# Altium schematic sheet 12-SoC POWER2.SchDoc
size 513 x 386 mm
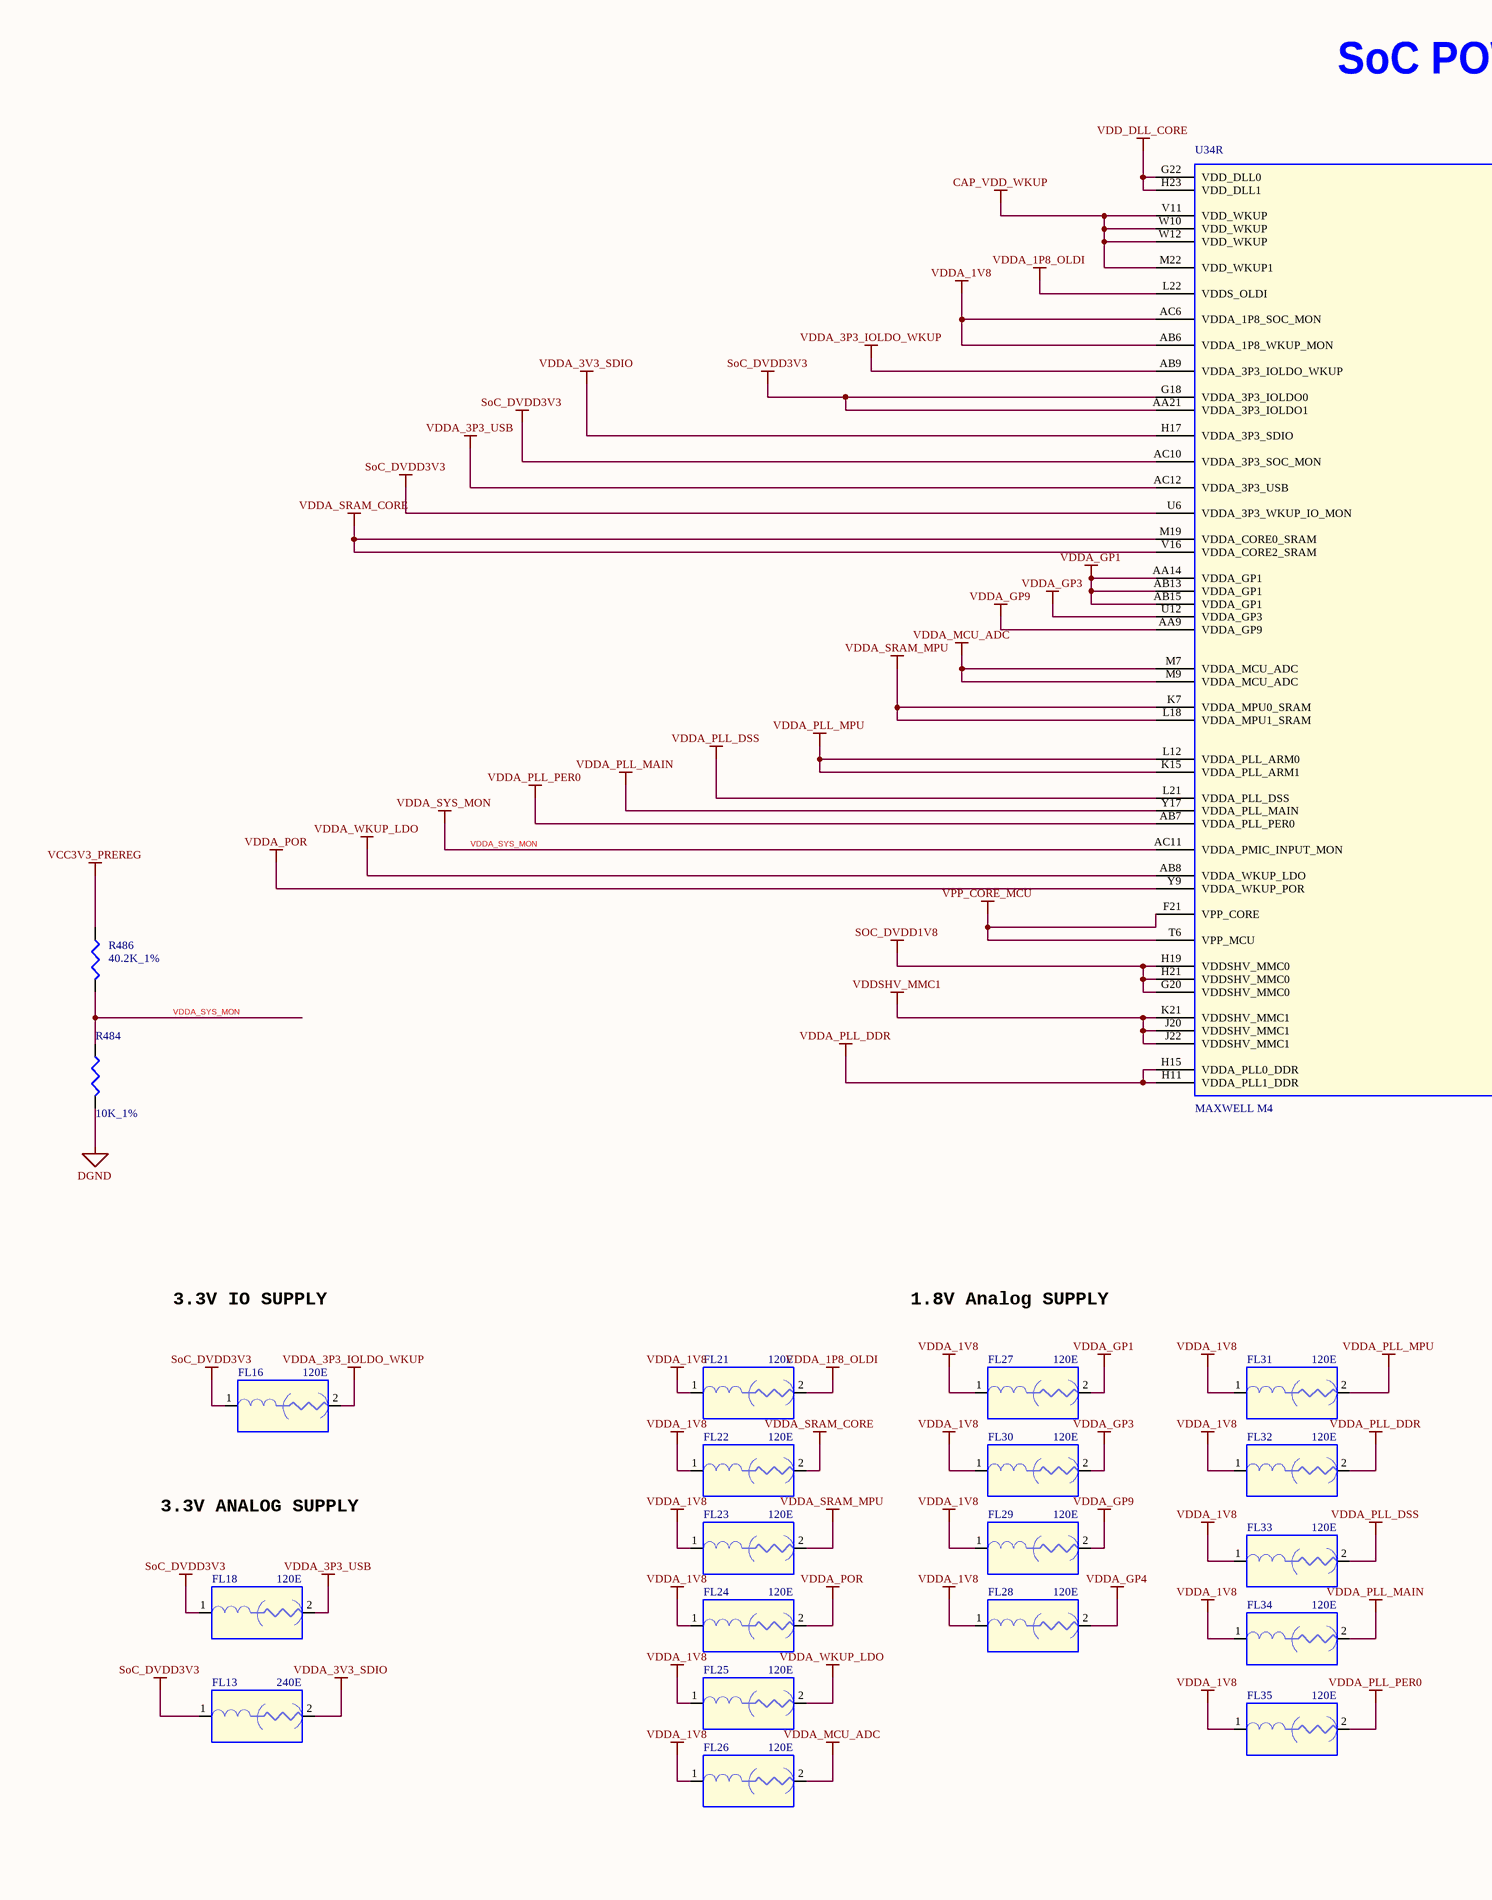
[diagram p0: 12-SoC POWER2.SchDoc, left]
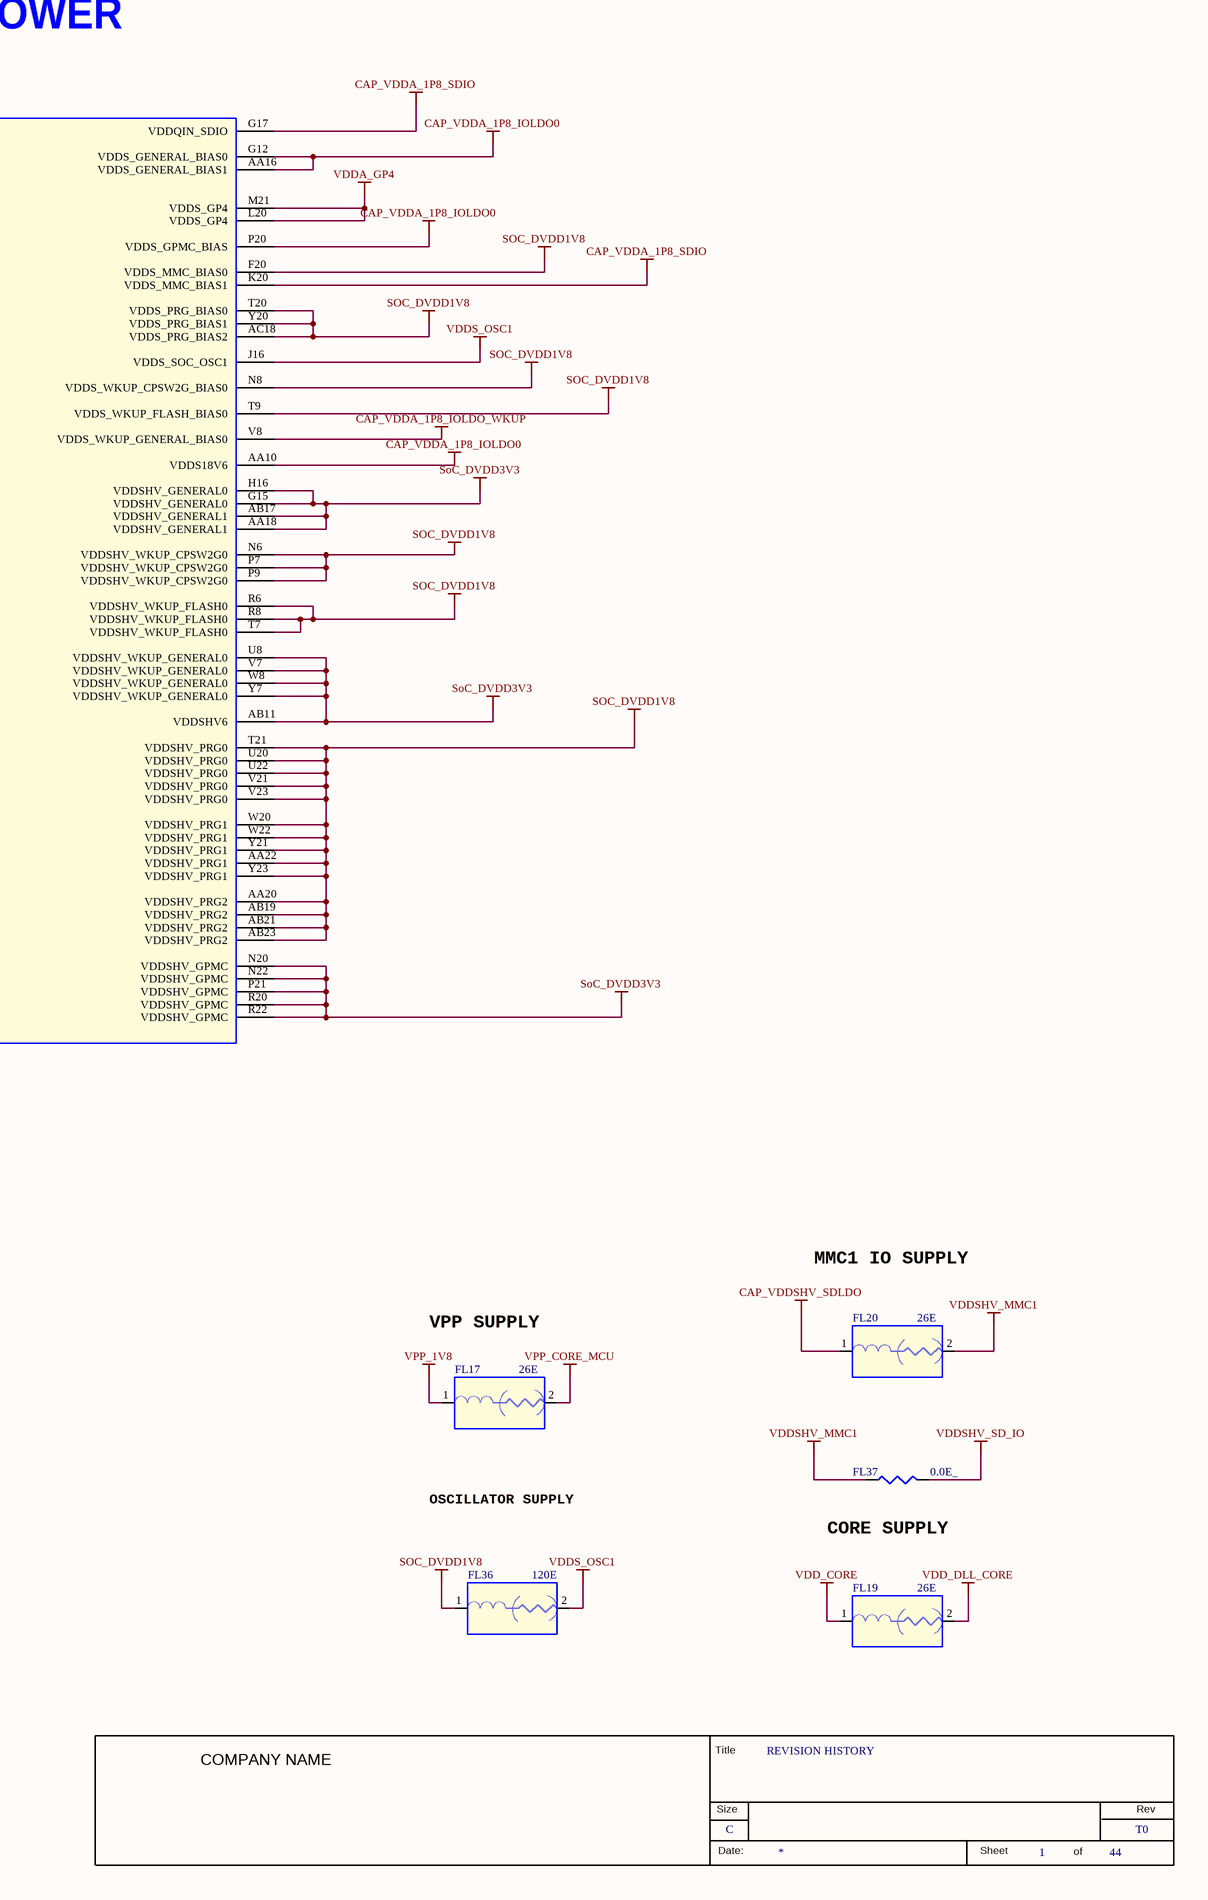
[diagram p1: 12-SoC POWER2.SchDoc, right]

## Parts
*  RevCode: T0  Title: REVISION HISTORY  Page Size: C  Page Number: 1  Page Count: 44  (hidden comment: TRAINING_TITLEBLK_CSIZE)  (graphical)
FL13  240E  [EMIFIL_BLM03B_0201]
FL16  120E  [EMIFIL_BLM18R_0603_1]
FL17  26E  [EMIFIL_BLM18K_0603]
FL18  120E  [EMIFIL_BLM18R_0603_1]
FL19  26E  [EMIFIL_BLM18K_0603]
FL20  26E  [EMIFIL_BLM18K_0603]
FL21  120E  [EMIFIL_BLM18R_0603_1]
FL22  120E  [EMIFIL_BLM18R_0603_1]
FL23  120E  [EMIFIL_BLM18R_0603_1]
FL24  120E  [EMIFIL_BLM18R_0603_1]
FL25  120E  [EMIFIL_BLM18R_0603_1]
FL26  120E  [EMIFIL_BLM18R_0603_1]
FL27  120E  [EMIFIL_BLM18R_0603_1]
FL28  120E  [EMIFIL_BLM18R_0603_1]
FL29  120E  [EMIFIL_BLM18R_0603_1]
FL30  120E  [EMIFIL_BLM18R_0603_1]
FL31  120E  [EMIFIL_BLM18R_0603_1]
FL32  120E  [EMIFIL_BLM18R_0603_1]
FL33  120E  [EMIFIL_BLM18R_0603_1]
FL34  120E  [EMIFIL_BLM18R_0603_1]
FL35  120E  [EMIFIL_BLM18R_0603_1]
FL36  120E  [EMIFIL_BLM18R_0603_1]
FL37  0.0E_  [RES0603]
R484  10K_1%  [RES0402_0-5]
R486  40.2K_1%  [RES0402_0-5]
U34  MAXWELL M4  [BGA784_31-49_910X910_1-7]  (part R of 19)

## Nets
CAP_VDD_WKUP: U34.M22(VDD_WKUP1) U34.V11(VDD_WKUP) U34.W10(VDD_WKUP) U34.W12(VDD_WKUP)
CAP_VDDA_1P8_IOLDO0: U34.AA10(VDDS18V6) U34.AA16(VDDS_GENERAL_BIAS1) U34.G12(VDDS_GENERAL_BIAS0) U34.P20(VDDS_GPMC_BIAS)
CAP_VDDA_1P8_IOLDO_WKUP: U34.V8(VDDS_WKUP_GENERAL_BIAS0)
CAP_VDDA_1P8_SDIO: U34.G17(VDDQIN_SDIO) U34.K20(VDDS_MMC_BIAS1)
CAP_VDDSHV_SDLDO: FL20.1
DGND: R484.2
SOC_DVDD1V8: FL36.1 U34.AA20(VDDSHV_PRG2) U34.AA22(VDDSHV_PRG1) U34.AB19(VDDSHV_PRG2) U34.AB21(VDDSHV_PRG2) U34.AB23(VDDSHV_PRG2) U34.AC18(VDDS_PRG_BIAS2) U34.F20(VDDS_MMC_BIAS0) U34.G20(VDDSHV_MMC0) U34.H19(VDDSHV_MMC0) U34.H21(VDDSHV_MMC0) U34.N6(VDDSHV_WKUP_CPSW2G0) U34.N8(VDDS_WKUP_CPSW2G_BIAS0) U34.P7(VDDSHV_WKUP_CPSW2G0) U34.P9(VDDSHV_WKUP_CPSW2G0) U34.R6(VDDSHV_WKUP_FLASH0) U34.R8(VDDSHV_WKUP_FLASH0) U34.T7(VDDSHV_WKUP_FLASH0) U34.T9(VDDS_WKUP_FLASH_BIAS0) U34.T20(VDDS_PRG_BIAS0) U34.T21(VDDSHV_PRG0) U34.U20(VDDSHV_PRG0) U34.U22(VDDSHV_PRG0) U34.V21(VDDSHV_PRG0) U34.V23(VDDSHV_PRG0) U34.W20(VDDSHV_PRG1) U34.W22(VDDSHV_PRG1) U34.Y20(VDDS_PRG_BIAS1) U34.Y21(VDDSHV_PRG1) U34.Y23(VDDSHV_PRG1)
SoC_DVDD3V3: FL13.1 FL16.1 FL18.1 U34.AA18(VDDSHV_GENERAL1) U34.AA21(VDDA_3P3_IOLDO1) U34.AB11(VDDSHV6) U34.AB17(VDDSHV_GENERAL1) U34.AC10(VDDA_3P3_SOC_MON) U34.G15(VDDSHV_GENERAL0) U34.G18(VDDA_3P3_IOLDO0) U34.H16(VDDSHV_GENERAL0) U34.N20(VDDSHV_GPMC) U34.N22(VDDSHV_GPMC) U34.P21(VDDSHV_GPMC) U34.R20(VDDSHV_GPMC) U34.R22(VDDSHV_GPMC) U34.U6(VDDA_3P3_WKUP_IO_MON) U34.U8(VDDSHV_WKUP_GENERAL0) U34.V7(VDDSHV_WKUP_GENERAL0) U34.W8(VDDSHV_WKUP_GENERAL0) U34.Y7(VDDSHV_WKUP_GENERAL0)
VCC3V3_PREREG: R486.1
VDD_CORE: FL19.1
VDD_DLL_CORE: FL19.2 U34.G22(VDD_DLL0) U34.H23(VDD_DLL1)
VDDA_1P8_OLDI: FL21.2 U34.L22(VDDS_OLDI)
VDDA_1V8: FL21.1 FL22.1 FL23.1 FL24.1 FL25.1 FL26.1 FL27.1 FL28.1 FL29.1 FL30.1 FL31.1 FL32.1 FL33.1 FL34.1 FL35.1 U34.AB6(VDDA_1P8_WKUP_MON) U34.AC6(VDDA_1P8_SOC_MON)
VDDA_3P3_IOLDO_WKUP: FL16.2 U34.AB9(VDDA_3P3_IOLDO_WKUP)
VDDA_3P3_USB: FL18.2 U34.AC12(VDDA_3P3_USB)
VDDA_3V3_SDIO: FL13.2 U34.H17(VDDA_3P3_SDIO)
VDDA_GP1: FL27.2 U34.AA14(VDDA_GP1) U34.AB13(VDDA_GP1) U34.AB15(VDDA_GP1)
VDDA_GP3: FL30.2 U34.U12(VDDA_GP3)
VDDA_GP4: FL28.2 U34.L20(VDDS_GP4) U34.M21(VDDS_GP4)
VDDA_GP9: FL29.2 U34.AA9(VDDA_GP9)
VDDA_MCU_ADC: FL26.2 U34.M7(VDDA_MCU_ADC) U34.M9(VDDA_MCU_ADC)
VDDA_PLL_DDR: FL32.2 U34.H11(VDDA_PLL1_DDR) U34.H15(VDDA_PLL0_DDR)
VDDA_PLL_DSS: FL33.2 U34.L21(VDDA_PLL_DSS)
VDDA_PLL_MAIN: FL34.2 U34.Y17(VDDA_PLL_MAIN)
VDDA_PLL_MPU: FL31.2 U34.K15(VDDA_PLL_ARM1) U34.L12(VDDA_PLL_ARM0)
VDDA_PLL_PER0: FL35.2 U34.AB7(VDDA_PLL_PER0)
VDDA_POR: FL24.2 U34.Y9(VDDA_WKUP_POR)
VDDA_SRAM_CORE: FL22.2 U34.M19(VDDA_CORE0_SRAM) U34.V16(VDDA_CORE2_SRAM)
VDDA_SRAM_MPU: FL23.2 U34.K7(VDDA_MPU0_SRAM) U34.L18(VDDA_MPU1_SRAM)
VDDA_SYS_MON: R484.1 R486.2 U34.AC11(VDDA_PMIC_INPUT_MON)
VDDA_WKUP_LDO: FL25.2 U34.AB8(VDDA_WKUP_LDO)
VDDS_OSC1: FL36.2 U34.J16(VDDS_SOC_OSC1)
VDDSHV_MMC1: FL20.2 FL37.1 U34.J20(VDDSHV_MMC1) U34.J22(VDDSHV_MMC1) U34.K21(VDDSHV_MMC1)
VDDSHV_SD_IO: FL37.2
VPP_1V8: FL17.1
VPP_CORE_MCU: FL17.2 U34.F21(VPP_CORE) U34.T6(VPP_MCU)

## Notes on the sheet
- SoC POWER
- 3.3V IO SUPPLY
- 1.8V Analog SUPPLY
- MMC1 IO SUPPLY
- VPP SUPPLY
- 3.3V ANALOG SUPPLY
- OSCILLATOR SUPPLY
- (near FL37) CORE SUPPLY
- (in symbol TRAINING_TITLEBLK_CSIZE) Title; COMPANY NAME; Size; Rev; Date:; Sheet; of

## Library data of the parts
* = TRAINING_TITLEBLK_CSIZE: Issue: 1.0; Page Create Date: Jan  8, 2022; Page Modify Date: *
FL13 = EMIFILTER_IND: FERRITE CHIP 240E 350mA 0201; Mistral Part No: 130014070021-R; Mfr_name: MURATA; Mfr_part_number: BLM03AX241SN1D; Part_type: MISC\FILTER; Project: HUMANWARE_PHOENIX; Tolerance: NA; Customs_HS_Code: 85437099; Custom_Duty: 24%; Library Ref: EMIFILTER_IND; PCB Footprint: EMIFIL_BLM03B_0201; Voltage: NA; Wattage: NA; Package: 0201; Distributor_name: DIGIKEY; Distributor_part_number: 490-5623-1-ND; Height: 0.33MM; Weight: NA; Temperature: -55°C+125°C; Datasheet: Y:\MIS_DATABASE\DATASHEETS\DISCRETES\INDUCTORS\BLM03AX.PDF; Crtd /date: NAVEED/140714; Chkd/date: VASANTHA/070814
FL16 FL18 FL21-FL23 FL25 FL27 FL30 FL32-FL35 = EMIFILTER_IND: FERRITE BEAD 120E 2A 0603; Mistral Part No: 130010060030-R; Mfr_name: MURATA; Mfr_part_number: BLM18EG121SN1D; Part_type: MISC\FILTER; Project: CENTAURUS; Tolerance: NA; Customs_HS_Code: 85437099; Custom_Duty: 24%; Footprint Path: Y:\MIS_DATABASE\Library\ALTIUM_TOOL\PCB_FOOTPRINTS\Altium_Footprint_Lib.PcbLib; Library Path: Y:\MIS_DATABASE\Library\ALTIUM_TOOL\SCHEMATICS_PARTS\MS_FILTER_Library.schlib; PCB Footprint: EMIFIL_BLM18R_0603_1; Voltage: NA; Wattage: NA; Package: 0603; Distributor_name: DIGIKEY; Distributor_part_number: 490-3991-1-ND; Library Ref: EMIFILTER_IND; Footprint Ref: EMIFIL_BLM18R_0603_1; Height: 0.95MM; Weight: NA; Temperature: -55°C+125°C; Datasheet: Y:\MIS_DATABASE\DATASHEETS\DISCRETES\INDUCTORS\BLM18E.PDF; Crtd /date: MUDDU/190610; Chkd/date: VASANTHA/061216; MECHANICAL 3D STEP FILE: EMIFIL_BLM18R_0603_1
FL17 = EMIFILTER_IND: FERRITE CHIP 26E 6A 0603; Mistral Part No: 130012010003-R; Mfr_name: MURATA; Mfr_part_number: BLM18KG260TN1D; Part_type: MISC\FILTER; Project: NA10NG; Tolerance: NA; Customs_HS_Code: 85437099; Custom_Duty: 24%; PCB Footprint: EMIFIL_BLM18K_0603; Voltage: NA; Wattage: NA; Package: 0603; Distributor_name: DIGIKEY; Distributor_part_number: 490-5252-1-ND; Library Ref: EMIFILTER_IND; Height: 0.75MM; Weight: NA; Temperature: -55°C+125°C; Datasheet: Y:\MIS_DATABASE\DATASHEETS\DISCRETES\INDUCTORS\BLM18K-SERIES.PDF; Crtd /date: CHAITHANYA/020112; Chkd/date: USMAN/020112
FL19 FL20 = EMIFILTER_IND: FERRITE CHIP 26E 6A 0603; Part_type: MISC\FILTER; Mfr_part_number: BLM18KG260TN1D; Mfr_name: MURATA; Mistral Part No: 130012010003-R; Custom_Duty: 24%; Customs_HS_Code: 85437099; Wattage: NA; Project: NA10NG; PCB Footprint: EMIFIL_BLM18K_0603; Chkd/date: USMAN/020112; Crtd /date: CHAITHANYA/020112; Datasheet: Y:\MIS_DATABASE\DATASHEETS\DISCRETES\INDUCTORS\BLM18K-SERIES.PDF; Temperature: -55°C+125°C; Weight: NA; Height: 0.75MM; Library Ref: EMIFILTER_IND; Distributor_part_number: 490-5252-1-ND; Distributor_name: DIGIKEY; Package: 0603; Voltage: NA; Tolerance: NA
FL24 FL26 FL28 FL29 FL31 FL36 = EMIFILTER_IND: FERRITE BEAD 120E 2A 0603; Part_type: MISC\FILTER; Mfr_part_number: BLM18EG121SN1D; Mfr_name: MURATA; Mistral Part No: 130010060030-R; Custom_Duty: 24%; Customs_HS_Code: 85437099; Wattage: NA; Project: CENTAURUS; Footprint Path: Y:\MIS_DATABASE\Library\ALTIUM_TOOL\PCB_FOOTPRINTS\Altium_Footprint_Lib.PcbLib; Library Path: Y:\MIS_DATABASE\Library\ALTIUM_TOOL\SCHEMATICS_PARTS\MS_FILTER_Library.schlib; PCB Footprint: EMIFIL_BLM18R_0603_1; MECHANICAL 3D STEP FILE: EMIFIL_BLM18R_0603_1; Chkd/date: VASANTHA/061216; Crtd /date: MUDDU/190610; Datasheet: Y:\MIS_DATABASE\DATASHEETS\DISCRETES\INDUCTORS\BLM18E.PDF; Temperature: -55°C+125°C; Weight: NA; Height: 0.95MM; Footprint Ref: EMIFIL_BLM18R_0603_1; Library Ref: EMIFILTER_IND; Distributor_part_number: 490-3991-1-ND; Distributor_name: DIGIKEY; Package: 0603; Voltage: NA; Tolerance: NA
FL37 = RESISTOR: RES 0.0E 1/10W 0603; Mistral Part No: 110010020006-P; Mfr_name: VISHAY; Mfr_part_number: CRCW06030000Z0EA; Part_type: RESISTORS\FIXED; Project: NPOL_CONTROLLERCARD; Voltage: 50V; Customs_HS_Code: 85332119; Custom_Duty: 15%; Wattage: 1/10W; Package: 0603; Distributor_name: DIGIKEY; Distributor_part_number: 541-0.0GCT-ND; Library Ref: RESISTOR; Height: 0.55MM; Weight: 2g/1000pcs; Temperature: -55°C+125°C; Datasheet: Y:\MIS_DATABASE\DATASHEETS\RESISTORS\CRCW.PDF; Crtd /date: MUDDU/050210; Chkd/date: SUHAS/230910; RoHS: Pb-Free; PCB Footprint: RES0603
R484 = RESISTOR_Dup5: RES 10K 1/16W 1% 0402; Part_type: RESISTORS\FIXED; Mfr_part_number: RC0402FR-0710KL; Mfr_name: YAGEO AMERICA; Mistral Part No: 110009030220-P; Custom_Duty: 15%; Customs_HS_Code: 85332119; Voltage: NA; Project: VOCERA; Footprint Path: Y:\MIS_DATABASE\Library\ALTIUM_TOOL\PCB_FOOTPRINTS\Altium_Footprint_Lib.PcbLib; Library Path: Y:\MIS_DATABASE\Library\ALTIUM_TOOL\SCHEMATICS_PARTS\MS_DISCRETE_Library.schlib; Footprint Ref: RES0402_0-5; Library Ref: RESISTOR; MECHANICAL 3D STEP FILE: RES0402_0-5; PCB Footprint: RES0402_0-5; RoHS: Pb-Free; Chkd/date: VASANTHA/201216; Crtd /date: GEETHA/290506; Datasheet: Y:\MIS_DATABASE\DATASHEETS\RESISTORS\YAGEO-RC0402.PDF; Temperature: -55°C+155°C; Weight: 0.65mg; Height: 0.40MM; Distributor_part_number: 311-10.0KLRTR-ND; Distributor_name: DIGIKEY; Package: 0402; Wattage: 1/16W; Tolerance: 1%
R486 = RESISTOR_Dup5: RES 40.2K 1/16W 1% 0402; Part_type: RESISTORS\FIXED; Mfr_part_number: RC0402FR-0740K2L; Mfr_name: YAGEO AMERICA; Mistral Part No: 110009030811; Custom_Duty: 15%; Customs_HS_Code: 85332119; Voltage: NA; Project: G4SLIM; PCB Footprint: RES0402_0-5; Footprint Path: Y:\MIS_DATABASE\Library\ALTIUM_TOOL\PCB_FOOTPRINTS\Altium_Footprint_Lib.PcbLib; Library Path: Y:\MIS_DATABASE\Library\ALTIUM_TOOL\SCHEMATICS_PARTS\MS_DISCRETE_Library.schlib; MECHANICAL 3D STEP FILE: RES0402_0-5; Chkd/date: VASANTHA/291216; Crtd /date: MAZHAR/170505; Datasheet: Y:\MIS_DATABASE\DATASHEETS\RESISTORS\YAGEO_RES.PDF; Temperature: -55°C+155°C; Weight: 0.65mg; Height: 0.40MM; Library Ref: RESISTOR; Distributor_part_number: 311-40.2KLRDKR-ND; Distributor_name: DIGIKEY; Package: 0402; Wattage: 1/16W; Tolerance: 1%; Footprint Ref: RES0402_0-5
U34 = AM654X_BGA784: IC MAXWELL MICRO CONTROLLER UNIT BGA784; Part_type: ICS\DIGITAL\MICROCONTROLLER; Mfr_part_number: MAXWELL M4_EVM; Mfr_name: TEXAS INSTRUMENTS; Mistral Part No: 141217100003; Custom_Duty: 15%; Customs_HS_Code: 85423100; Wattage: NA; Project: TI_MAXIE_CPB; Library Ref: AM654X_BGA784; PCB Footprint: BGA784_31-49_910X910_1-7; MECHANICAL 3D STEP FILE: BGA784_31-49_910X910_1-7; Chkd/date: MANIRAJA/130717; Crtd /date: MANIRAJA/130717; Datasheet: Y:\MIS_DATABASE\DATASHEETS\ICS\DIGITAL\MICROCONTROLLER\MAXWELLM4.PDF; Temperature: NA; Weight: NA; Height: 1.63MM; Distributor_part_number: NA; Distributor_name: NA; Package: BGA784; Voltage: NA; Tolerance: NA